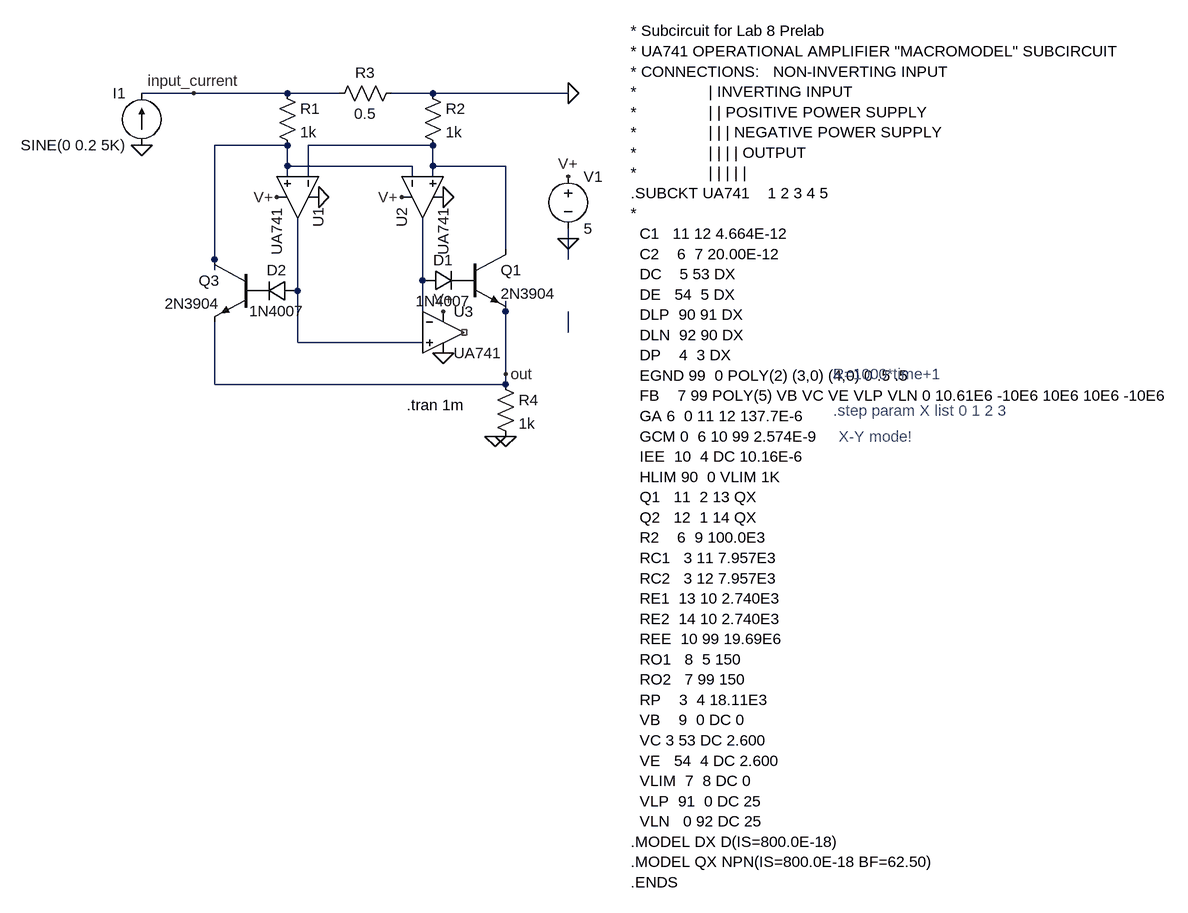
[diagram p0: schematic max471超級麻煩.asc]
max471超級麻煩.asc, the LTspice schematic file:
Version 4
SHEET 1 1376 1100
WIRE -144 -16 -224 -16
WIRE 0 -16 -144 -16
WIRE 80 -16 0 -16
WIRE 224 -16 160 -16
WIRE 432 -16 224 -16
WIRE 0 64 -112 64
WIRE 224 64 32 64
WIRE 0 96 0 64
WIRE 192 96 0 96
WIRE 224 96 224 64
WIRE 336 96 224 96
WIRE 0 112 0 96
WIRE 32 112 32 64
WIRE 192 112 192 96
WIRE 224 112 224 96
WIRE 432 208 432 192
WIRE 336 224 336 96
WIRE -112 240 -112 64
WIRE 432 240 432 208
WIRE -112 256 -112 240
WIRE 208 272 208 176
WIRE 16 288 16 176
WIRE 336 320 336 304
WIRE 208 336 208 272
WIRE 432 352 432 320
WIRE 16 368 16 288
WIRE 208 368 16 368
WIRE 336 416 336 320
WIRE -112 432 -112 336
WIRE 336 432 336 416
WIRE 336 432 -112 432
FLAG 432 208 0
FLAG 432 112 V+
FLAG 176 144 V+
FLAG -16 144 V+
FLAG 240 320 V+
FLAG 240 144 0
FLAG 48 144 0
FLAG 240 384 0
FLAG -224 64 0
FLAG 432 -16 0
FLAG 336 416 out
FLAG -144 -16 input_current
FLAG 320 512 0
FLAG 336 512 0
SYMBOL OpAmps\\opamp2 80 144 R90
SYMATTR InstName U1
SYMATTR Value UA741
SYMBOL voltage 432 96 R0
WINDOW 123 0 0 Left 0
WINDOW 39 0 0 Left 0
SYMATTR InstName V1
SYMATTR Value 5
SYMBOL OpAmps\\opamp2 144 144 M90
SYMATTR InstName U2
SYMATTR Value UA741
SYMBOL OpAmps\\opamp2 240 288 R0
SYMATTR InstName U3
SYMATTR Value UA741
SYMBOL diode 208 288 R270
WINDOW 0 32 32 VTop 2
WINDOW 3 0 32 VBottom 2
SYMATTR InstName D1
SYMATTR Value 1N4007
SYMBOL diode 16 272 R90
WINDOW 0 0 32 VBottom 2
WINDOW 3 32 32 VTop 2
SYMATTR InstName D2
SYMATTR Value 1N4007
SYMBOL res -16 -32 R0
SYMATTR InstName R1
SYMATTR Value 1k
SYMBOL res 208 -32 R0
SYMATTR InstName R2
SYMATTR Value 1k
SYMBOL res 176 -32 R90
WINDOW 0 0 56 VBottom 2
WINDOW 3 32 56 VTop 2
SYMATTR InstName R3
SYMATTR Value 0.5
SYMBOL npn 272 224 R0
SYMATTR InstName Q1
SYMATTR Value 2N3904
SYMBOL current -224 64 R180
WINDOW 0 24 80 Left 2
WINDOW 3 24 0 Left 2
WINDOW 123 0 0 Left 0
WINDOW 39 0 0 Left 0
SYMATTR InstName I1
SYMATTR Value SINE(0 0.2 5K)
SYMBOL npn -48 240 M0
SYMATTR InstName Q3
SYMATTR Value 2N3904
SYMBOL res 320 416 R0
SYMATTR InstName R4
SYMATTR Value 1k
TEXT 528 -112 Left 2 !* Subcircuit for Lab 8 Prelab\n* UA741 OPERATIONAL AMPLIFIER "MACROMODEL" SUBCIRCUIT\n* CONNECTIONS:   NON-INVERTING INPUT\n*                | INVERTING INPUT\n*                | | POSITIVE POWER SUPPLY\n*                | | | NEGATIVE POWER SUPPLY\n*                | | | | OUTPUT\n*                | | | | |\n.SUBCKT UA741    1 2 3 4 5\n*\n  C1   11 12 4.664E-12\n  C2    6  7 20.00E-12\n  DC    5 53 DX\n  DE   54  5 DX\n  DLP  90 91 DX\n  DLN  92 90 DX\n  DP    4  3 DX\n  EGND 99  0 POLY(2) (3,0) (4,0) 0 .5 .5\n  FB    7 99 POLY(5) VB VC VE VLP VLN 0 10.61E6 -10E6 10E6 10E6 -10E6\n  GA 6  0 11 12 137.7E-6\n  GCM 0  6 10 99 2.574E-9\n  IEE  10  4 DC 10.16E-6\n  HLIM 90  0 VLIM 1K\n  Q1   11  2 13 QX\n  Q2   12  1 14 QX\n  R2    6  9 100.0E3\n  RC1   3 11 7.957E3\n  RC2   3 12 7.957E3\n  RE1  13 10 2.740E3\n  RE2  14 10 2.740E3\n  REE  10 99 19.69E6\n  RO1   8  5 150\n  RO2   7 99 150\n  RP    3  4 18.11E3\n  VB    9  0 DC 0\n  VC 3 53 DC 2.600\n  VE   54  4 DC 2.600\n  VLIM  7  8 DC 0\n  VLP  91  0 DC 25\n  VLN   0 92 DC 25\n.MODEL DX D(IS=800.0E-18)\n.MODEL QX NPN(IS=800.0E-18 BF=62.50)\n.ENDS
TEXT 840 416 Left 2 ;R=1000*time+1
TEXT 840 472 Left 2 ;.step param X list 0 1 2 3
TEXT 848 512 Left 2 ;X-Y mode!
TEXT 184 464 Left 2 !.tran 1m

The netlist it stands for:
* max471超級麻煩.asc
XU1 N001 N002 0 V+ N004 UA741  ; pins In+ In- V+ V- OUT
V1 V+ 0 5
XU2 N002 N001 V+ 0 N003 UA741  ; pins In+ In- V+ V- OUT
XU3 N004 N003 V+ 0 NC_01 UA741  ; pins In+ In- V+ V- OUT
D1 N003 P001 1N4007
D2 N004 P002 1N4007
R1 input_current N001 1k
R2 0 N002 1k
R3 0 input_current 0.5
Q1 N002 P001 out 0 2N3904
I1 0 input_current SINE(0 0.2 5K)
Q3 N001 P002 out 0 2N3904
R4 out 0 1k
.model D D
.lib standard.dio
.model NPN NPN
.model PNP PNP
.lib standard.bjt
* Subcircuit for Lab 8 Prelab
* UA741 OPERATIONAL AMPLIFIER "MACROMODEL" SUBCIRCUIT
* CONNECTIONS:   NON-INVERTING INPUT
*                | INVERTING INPUT
*                | | POSITIVE POWER SUPPLY
*                | | | NEGATIVE POWER SUPPLY
*                | | | | OUTPUT
*                | | | | |
.SUBCKT UA741    1 2 3 4 5
*
  C1   11 12 4.664E-12
  C2    6  7 20.00E-12
  DC    5 53 DX
  DE   54  5 DX
  DLP  90 91 DX
  DLN  92 90 DX
  DP    4  3 DX
  EGND 99  0 POLY(2) (3,0) (4,0) 0 .5 .5
  FB    7 99 POLY(5) VB VC VE VLP VLN 0 10.61E6 -10E6 10E6 10E6 -10E6
  GA 6  0 11 12 137.7E-6
  GCM 0  6 10 99 2.574E-9
  IEE  10  4 DC 10.16E-6
  HLIM 90  0 VLIM 1K
  Q1   11  2 13 QX
  Q2   12  1 14 QX
  R2    6  9 100.0E3
  RC1   3 11 7.957E3
  RC2   3 12 7.957E3
  RE1  13 10 2.740E3
  RE2  14 10 2.740E3
  REE  10 99 19.69E6
  RO1   8  5 150
  RO2   7 99 150
  RP    3  4 18.11E3
  VB    9  0 DC 0
  VC 3 53 DC 2.600
  VE   54  4 DC 2.600
  VLIM  7  8 DC 0
  VLP  91  0 DC 25
  VLN   0 92 DC 25
.MODEL DX D(IS=800.0E-18)
.MODEL QX NPN(IS=800.0E-18 BF=62.50)
.ENDS
* R=1000*time+1
* .step param X list 0 1 2 3
* X-Y mode!
.tran 1m
.backanno
.end